# EAGLE design v00_hardware_hole (EAGLE 8.6.1)
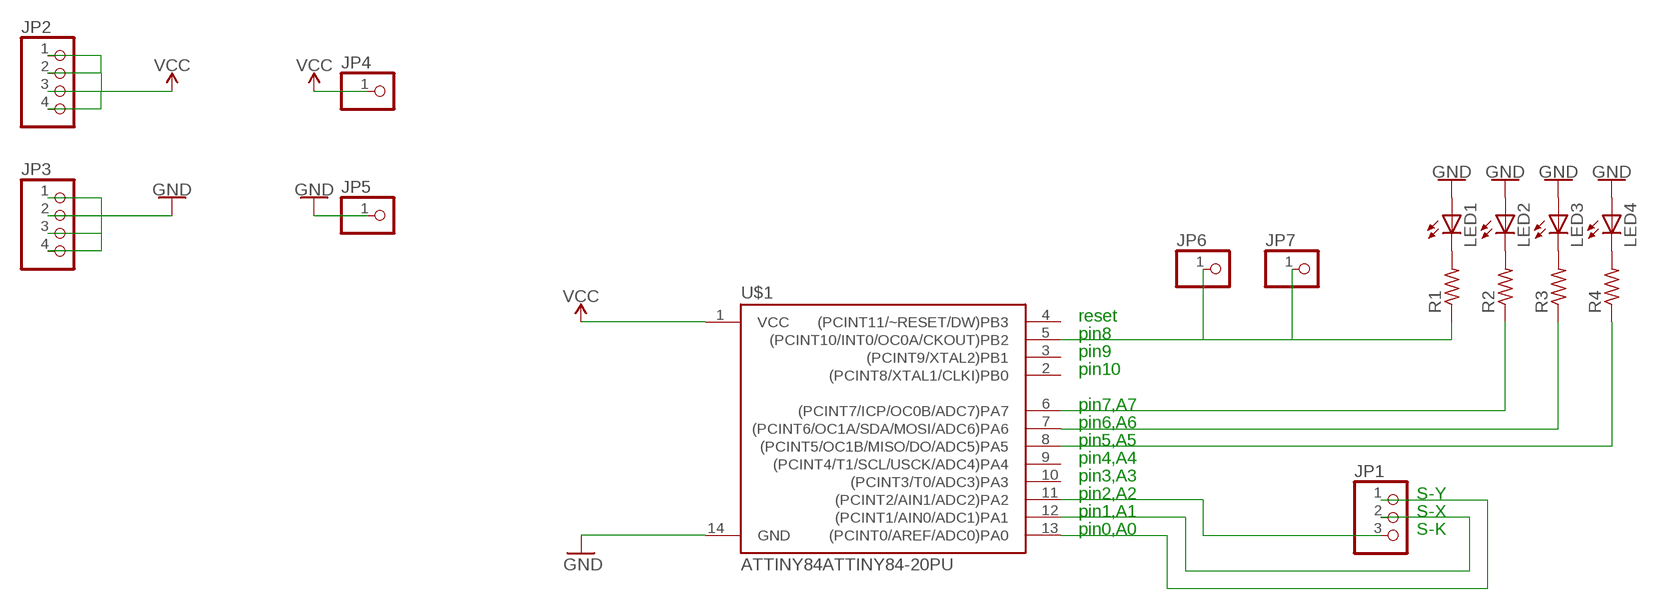
[diagram p0: schematic, sheet 1]

## Parts
JP1  PINHD-1X3  [1X03]
JP2  PINHD-1X4  [1X04]
JP3  PINHD-1X4  [1X04]
JP4  PINHD-1X1  [1X01]
JP5  PINHD-1X1  [1X01]
JP6  PINHD-1X1  [1X01]
JP7  PINHD-1X1  [1X01]
LED1  LED5MM  [LED5MM]
LED2  LED5MM  [LED5MM]
LED3  LED5MM  [LED5MM]
LED4  LED5MM  [LED5MM]
R1  R-US_0204/7  [0204/7]
R2  R-US_0204/7  [0204/7]
R3  R-US_0204/7  [0204/7]
R4  R-US_0204/7  [0204/7]
U$1  ATTINY84ATTINY84-20PU  [DIP14]

## Nets
GND: JP3.1 JP3.2 JP3.3 JP3.4 JP5.1 LED1.A LED2.A LED3.A LED4.A U$1.14(GND)
N$1: LED1.K(C) R1.2
N$2: LED2.K(C) R2.2
N$3: LED3.K(C) R3.2
N$4: LED4.K(C) R4.2
N$5: JP1.1 U$1.13((PCINT0/AREF/ADC0)PA0)
N$6: JP1.2 U$1.12((PCINT1/AIN0/ADC1)PA1)
N$7: JP6.1 JP7.1 R1.1 U$1.5((PCINT10/INT0/OC0A/CKOUT)PB2)
N$8: R2.1 U$1.6((PCINT7/ICP/OC0B/ADC7)PA7)
N$9: R3.1 U$1.7((PCINT6/OC1A/SDA/MOSI/ADC6)PA6)
N$10: R4.1 U$1.8((PCINT5/OC1B/MISO/DO/ADC5)PA5)
N$11: JP1.3 U$1.11((PCINT2/AIN1/ADC2)PA2)
VCC: JP2.1 JP2.2 JP2.3 JP2.4 JP4.1 U$1.1(VCC)
Unconnected: U$1.2((PCINT8/XTAL1/CLKI)PB0) U$1.3((PCINT9/XTAL2)PB1) U$1.4((PCINT11/~RESET/DW)PB3) U$1.9((PCINT4/T1/SCL/USCK/ADC4)PA4) U$1.10((PCINT3/T0/ADC3)PA3)

## Notes on the sheet
- reset
- pin8
- pin9
- pin10
- pin7,A7
- pin6,A6
- pin5,A5
- pin4,A4
- pin3,A3
- pin2,A2 | S-Y
- pin1,A1 | S-X
- pin0,A0 | S-K

## Library data of the parts
JP1 = pinhead:PINHD-1X3: PIN HEADER
JP2 JP3 = pinhead:PINHD-1X4: PIN HEADER
JP4-JP7 = adafruit:PINHD-1X1: Pin header 1x1 for 0.1" spacing With round pins
LED1-LED4 = adafruit:LED: LED OSRAM: - CHIPLED LG R971, LG N971, LY N971, LG Q971, LY Q971, LO R971, LY R971 LH N974, LH R974 LS Q976, LO Q976, LY Q976 LO Q996 - Hyper CHIPLED LW Q18S LB Q993, LB Q99A, LB R99A - SideLED LS A670, LO A670, LY A670, LG A670, LP A670 LB A673, LV A673, LT A673, LW A673 LH A674 LY A675 LS A676, LA A676, LO A676, LY A676, LW A676 LS A679, LY A679, LG A679 - Hyper Micro SIDELED® LS Y876, LA Y876, LO Y876, LY Y876 LT Y87S - SmartLED LW L88C, LW L88S LB L89C, LB L89S, LG L890 LS L89K, LO L89K, LY L89K LS L896, LA L896, LO L896, LY L896 - TOPLED LS T670, LO T670, LY T670, LG T670, LP T670 LSG T670, LSP T670, LSY T670, LOP T670, LYG T670 LG T671, LOG T671, LSG T671 LB T673, LV T673, LT T673, LW T673 LH T674 LS T676, LA T676, LO T676, LY T676, LB T676, LH T676, LSB T676, LW T676 LB T67C, LV T67C, LT T67C, LS T67K, LO T67K, LY T67K, LW E67C LS E67B, LA E67B, LO E67B, LY E67B, LB E67C, LV E67C, LT E67C LW T67C LS T679, LY T679, LG T679 LS T770, LO T770, LY T770, LG T770, LP T770 LB T773, LV T773, LT T773, LW T773 LH T774 LS E675, LA E675, LY E675, LS T675 LS T776, LA T776, LO T776, LY T776, LB T776 LHGB T686 LT T68C, LB T68C - Hyper Mini TOPLED® LB M676 - Mini TOPLED Santana® LG M470 LS M47K, LO M47K, LY M47K Source: http://www.osram.convergy.de/
R1-R4 = adafruit:R-US_: RESISTOR, American symbol
U$1 = SparkFun-IC-Microcontroller:ATTINY84: Atmel 14-pin 2/4/8kB flash uC Datasheet <https://cdn.sparkfun.com/datasheets/Widgets/doc8006.pdf> SparkFun Products Tiny AVR Programmer <https://www.sparkfun.com/products/11801> (PGM-11801) SparkFun Servo Trigger - Continuous Rotation <https://www.sparkfun.com/products/13872> (WIG-13872) SparkFun Servo Trigger <https://www.sparkfun.com/products/13118> (WIG-13118)

## Board
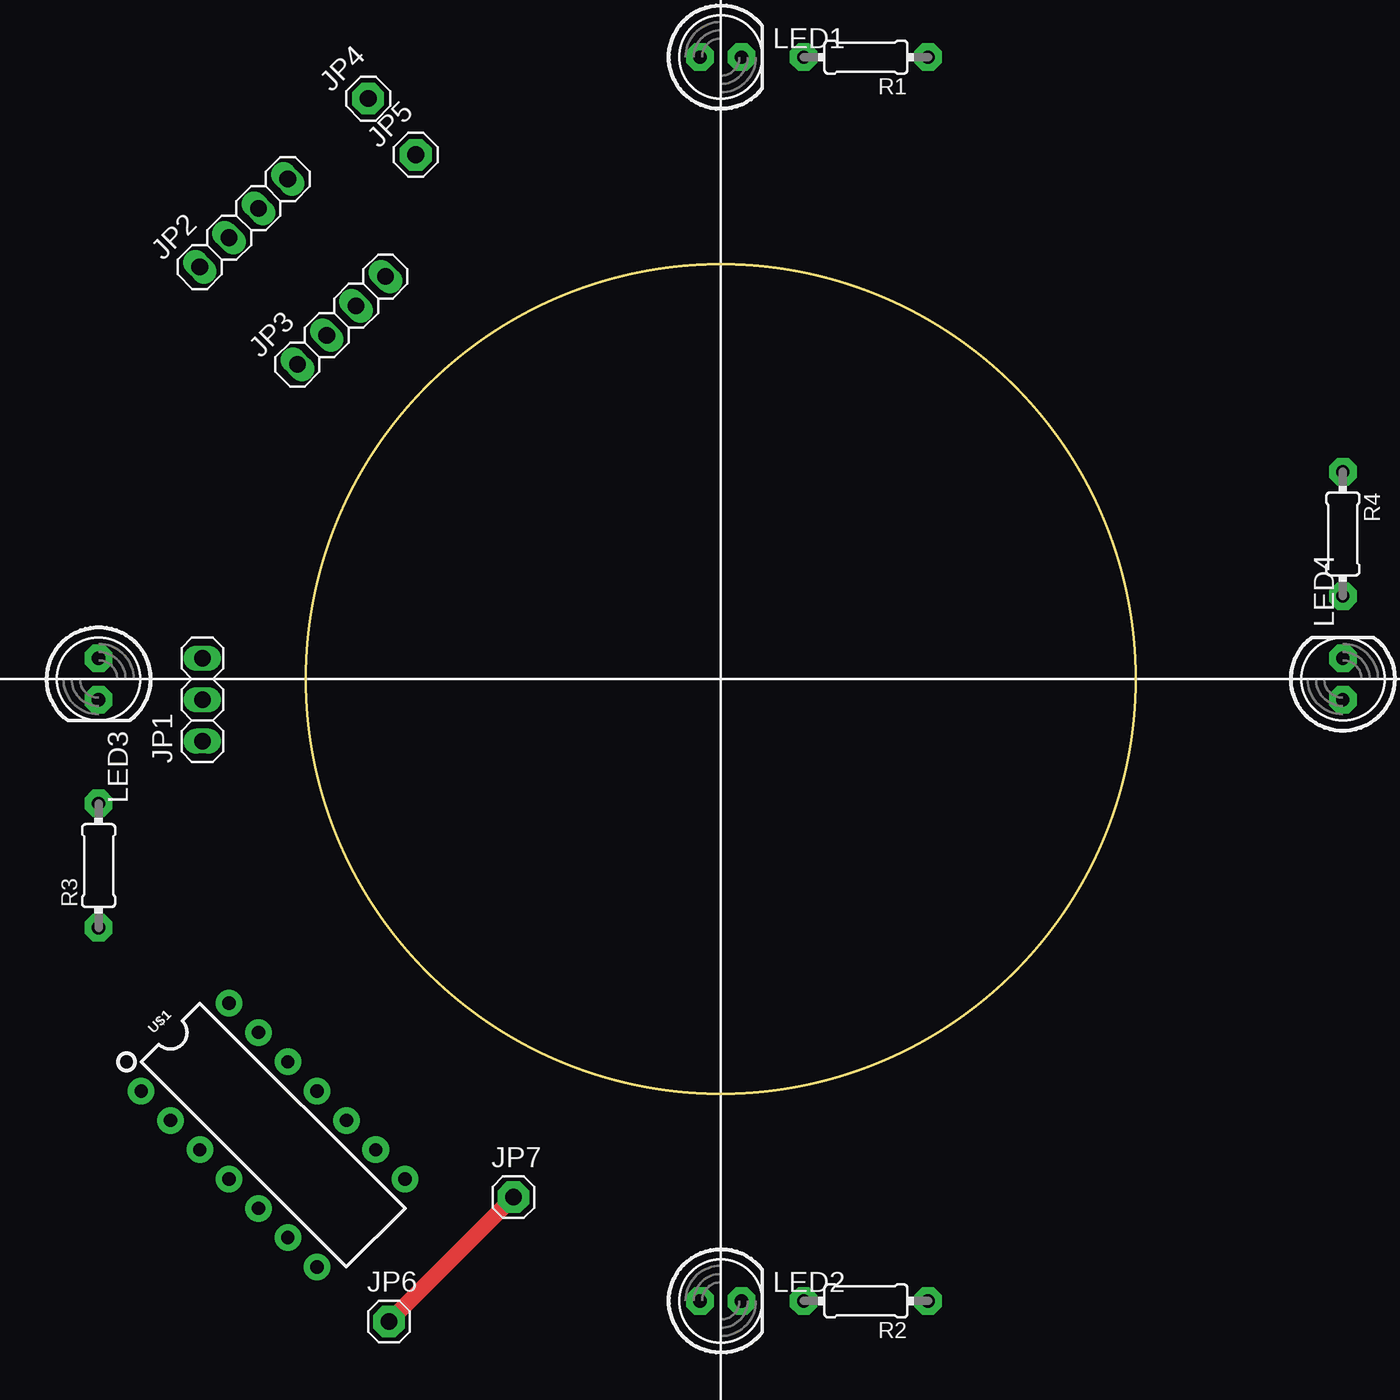
[diagram p1: board, top side]
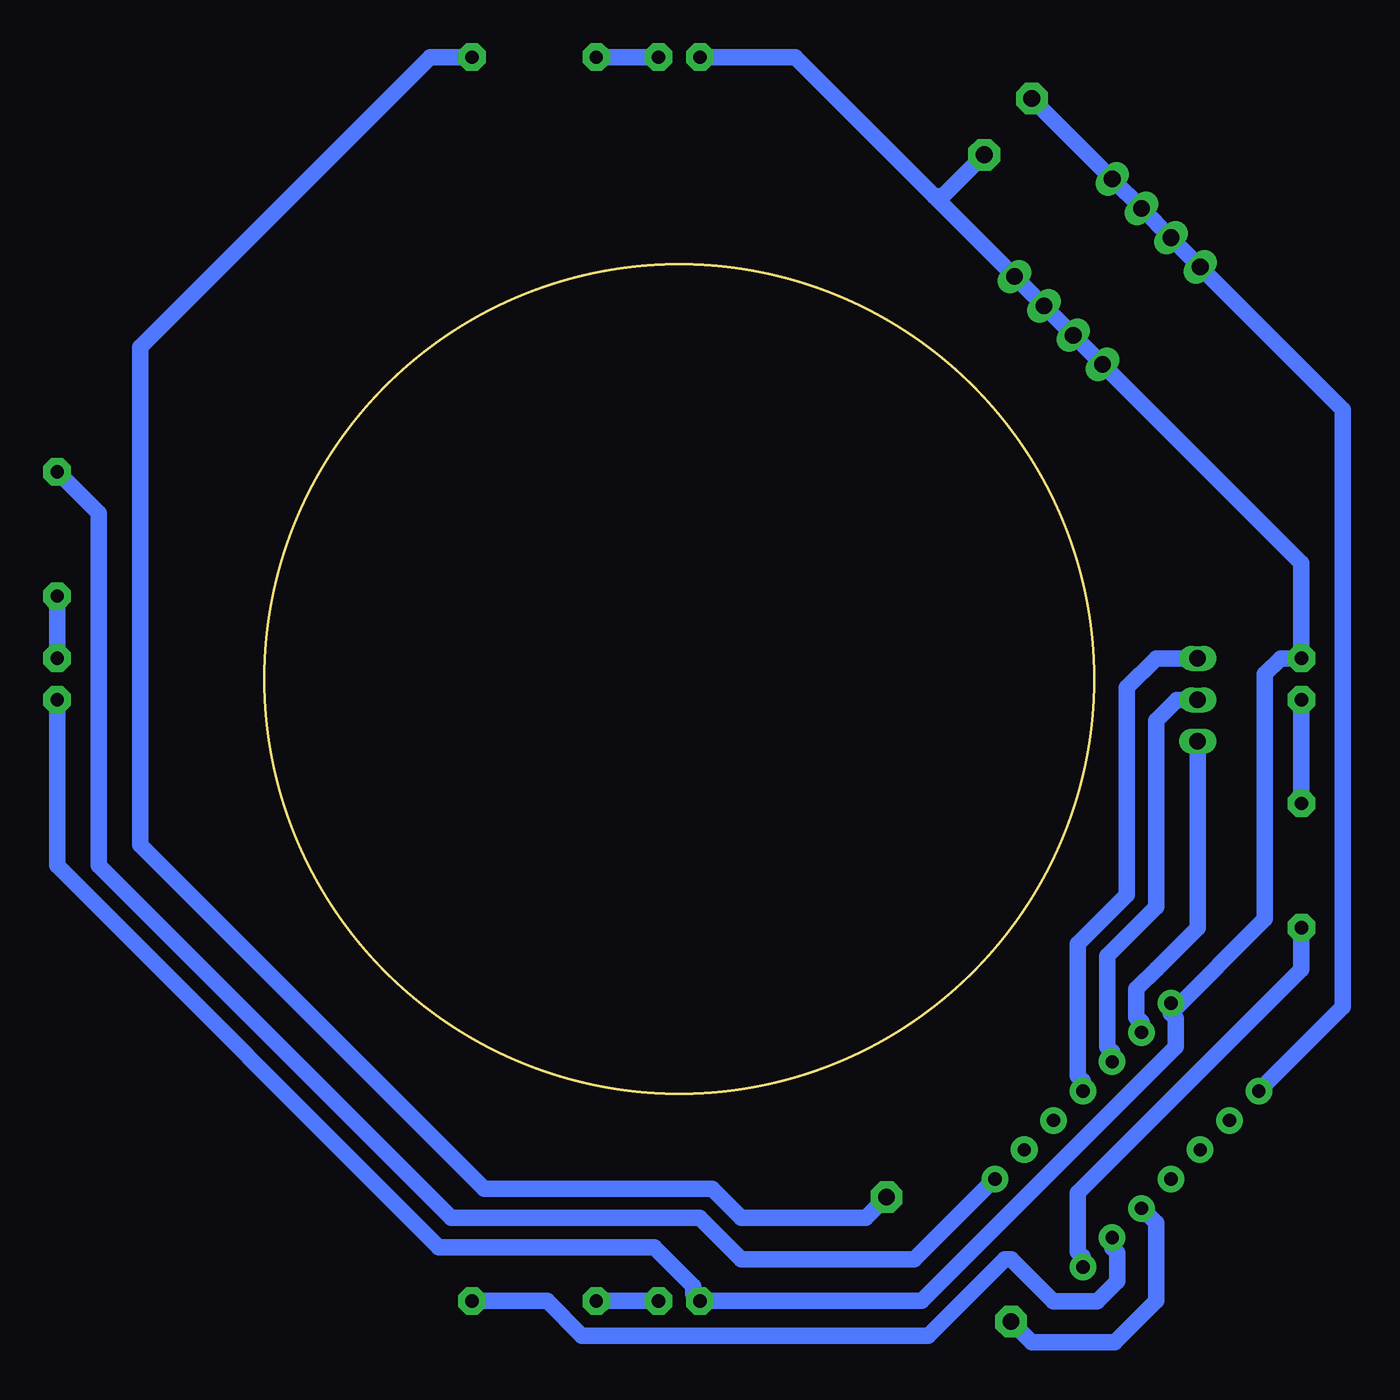
[diagram p2: board, bottom side, seen from below]

Size 50.8 x 50.8 mm. Coordinates in mm from the lower left corner, seen from the top.
Outline: circle at 25.4,25.4 radius 25.4
Copper layers (1*16): Top 0.035mm / dielectric 1.5mm / Bottom 0.035mm
Design rules "OthermillDRC_1_32_v2": minimum track width 8mil, minimum drill 0.8mm, track to track 0.794003125mm, track to pad 0.794003125mm, pad to pad 0.794003125mm, via to via 0.794003125mm, smd to smd 0mil, copper to edge 0mil, drill to drill 1mil, minimum pad ring 10mil, minimum via ring 10mil, stop-mask expansion 1mil, vias tented up to drill 30mil, thermal gap 10mil

### Footprints (pad centres in the part's own frame; a part is rotated, then mirrored left to right if it is on the bottom)
1X03 = drill 1.016 long: 1 -2.54,0; 2 0,0; 3 2.54,0
1X04 = drill 1.016 long: 1 -3.81,0; 2 -1.27,0; 3 1.27,0; 4 3.81,0
1X01 = drill 1.016 pad 1.93 octagon: 1 0,0
LED5MM = drill 0.813 pad 1.676 octagon: A -1.27,0; K 1.27,0
0204/7 = drill 0.813 pad 1.676 octagon: 1 -3.81,0; 2 3.81,0
DIP14 = drill 0.813 pad 1.626: 1 -7.62,-3.81; 2 -5.08,-3.81; 3 -2.54,-3.81; 4 0,-3.81; 5 2.54,-3.81; 6 5.08,-3.81; 7 7.62,-3.81; 8 7.62,3.81; 9 5.08,3.81; 10 2.54,3.81; 11 0,3.81; 12 -2.54,3.81; 13 -5.08,3.81; 14 -7.62,3.81

### Placement (x,y rotation side)
JP1  -6.35,24.13 90 top  (outside the outline)
JP2  -3.81,53.34 45 top
JP3  2.17,47.36 45 top
JP4  3.81,60.96 45 top  (outside the outline)
JP5  6.72,57.52 45 top  (outside the outline)
JP6  5.08,-13.97 0 top  (outside the outline)
JP7  12.7,-6.35 0 top  (outside the outline)
LED1  25.4,63.5 0 top  (outside the outline)
LED2  25.4,-12.7 0 top  (outside the outline)
LED3  -12.7,25.4 270 top  (outside the outline)
LED4  63.5,25.4 90 top  (outside the outline)
R1  34.29,63.5 180 top  (outside the outline)
R2  34.29,-12.7 180 top  (outside the outline)
R3  -12.7,13.97 90 top  (outside the outline)
R4  63.5,34.29 270 top  (outside the outline)
U$1  -2.01,-2.54 315 top

### Tracks (layer width: path | path; a pad name or v marks a point on that pad's centre or on a via)
GND
  Bottom 1: -4.71,4.93 -5.02,4.62 -5.02,2.87 10.55,-12.7 LED2.A 24.54,-12.29 24.54,-11.82 26.94,-9.41 40.12,-9.41 63.5,13.97 LED4.A | -4.71,4.93 U$1.14 | -4.71,4.93 -10.47,10.69 -10.47,25.71 -11.43,26.67 LED3.A -12.7,32.49 JP3.1 JP3.2 JP3.3 JP3.4 9.79,54.98 | 9.79,54.98 18.31,63.5 LED1.A | JP5.1 9.26,54.98 9.79,54.98
N$1
  Bottom 1: R1.2 LED1.K
N$2
  Bottom 1: LED2.K R2.2
N$3
  Bottom 1: LED3.K R3.2
N$4
  Bottom 1: LED4.K R4.2
N$5
  Bottom 1: U$1.13 -2.91,4.36 -2.6,4.67 -2.6,6.42 -3.84,7.65 -6.35,10.16 JP1.1
N$6
  Bottom 1: JP1.2 -5.08,24.13 -3.81,22.86 -3.81,11.43 -0.81,8.43 -0.81,2.87 -1.12,2.56 U$1.12
N$7
  Top 1: JP6.1 JP7.1
  Bottom 1: R1.1 40.64,63.5 58.42,45.72 58.42,15.24 37.35,-5.83 23.39,-5.83 21.59,-7.62 13.97,-7.62 JP7.1 | U$1.5 -3.81,-7.93 -3.81,-12.7 -1.27,-15.24 3.81,-15.24 JP6.1
N$8
  Bottom 1: U$1.6 -1.12,-9.44 -1.43,-9.75 -1.43,-11.49 -0.19,-12.73 2.51,-12.73 5.08,-10.16 5.48,-10.16 10.15,-14.83 31.36,-14.83 33.49,-12.7 R2.1
N$9
  Bottom 1: R3.1 -12.7,7.62 0.99,-6.07 0.99,-9.7 0.68,-10.01 U$1.7
N$10
  Bottom 1: U$1.8 10.99,-10.16 21.59,-10.16 24.13,-7.62 39.37,-7.62 60.96,13.97 60.96,35.56 R4.1
N$11
  Bottom 1: JP1.3 -3.81,26.67 -2.02,24.88 -2.02,12.17 0.99,9.17 0.99,1.08 0.68,0.77 U$1.11
VCC
  Bottom 1: U$1.1 -15.24,5.3 -15.24,41.91 JP2.1 JP2.2 JP2.3 JP2.4 JP4.1